# Altium schematic sheet Digital Isolation.SchDoc
size A4; SheetNumber: 5; SheetTotal: 7
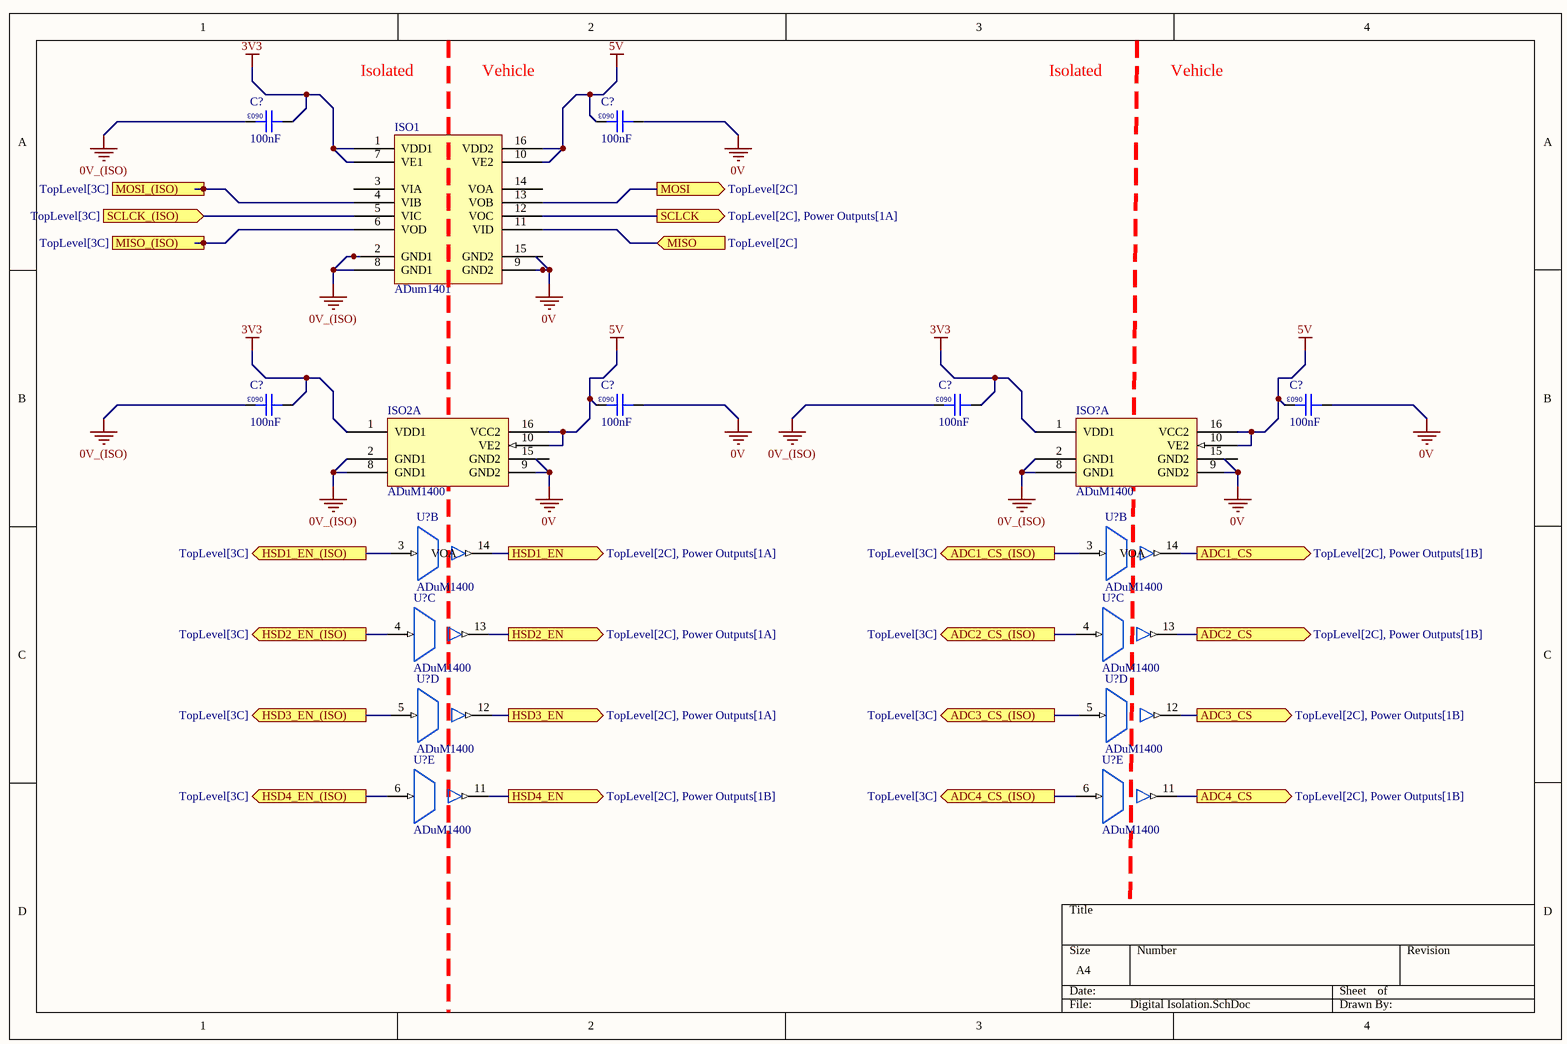
[diagram p0: Digital Isolation.SchDoc]

## Parts
(Parts that share a designator on the sheet are numbered #1, #2 ... from top to bottom, then left to right.)
C?#1  100nF  [0603]
C?#2  100nF  [0603]
C?#3  100nF  [0603]
C?#4  100nF  [0603]
C?#5  100nF  [0603]
C?#6  100nF  [0603]
ISO1  ADum1401  [AD 16-SOIC]
ISO2  ADuM1400  [AD 16-SOIC]  (part A of 5)
ISO?  ADuM1400  [AD 16-SOIC]  (part A of 5)
U?#1  ADuM1400  [AD 16-SOIC]  (part B of 5)
U?#2  ADuM1400  [AD 16-SOIC]  (part B of 5)
U?#3  ADuM1400  [AD 16-SOIC]  (part C of 5)
U?#4  ADuM1400  [AD 16-SOIC]  (part C of 5)
U?#5  ADuM1400  [AD 16-SOIC]  (part D of 5)
U?#6  ADuM1400  [AD 16-SOIC]  (part D of 5)
U?#7  ADuM1400  [AD 16-SOIC]  (part E of 5)
U?#8  ADuM1400  [AD 16-SOIC]  (part E of 5)

## Ports
ADC1_CS (out, see TopLevel[2C], Power Outputs[1B]), ADC1_CS_(ISO) (out, see TopLevel[3C]), ADC2_CS (out, see TopLevel[2C], Power Outputs[1B]), ADC2_CS_(ISO) (out, see TopLevel[3C]), ADC3_CS (out, see TopLevel[2C], Power Outputs[1B]), ADC3_CS_(ISO) (out, see TopLevel[3C]), ADC4_CS (out, see TopLevel[2C], Power Outputs[1B]), ADC4_CS_(ISO) (out, see TopLevel[3C]), HSD1_EN (out, see TopLevel[2C], Power Outputs[1A]), HSD1_EN_(ISO) (out, see TopLevel[3C]), HSD2_EN (out, see TopLevel[2C], Power Outputs[1A]), HSD2_EN_(ISO) (out, see TopLevel[3C]), HSD3_EN (out, see TopLevel[2C], Power Outputs[1A]), HSD3_EN_(ISO) (out, see TopLevel[3C]), HSD4_EN (out, see TopLevel[2C], Power Outputs[1B]), HSD4_EN_(ISO) (out, see TopLevel[3C]), MISO (in, see TopLevel[2C]), MISO_(ISO) (out, see TopLevel[3C]), MOSI (out, see TopLevel[2C]), MOSI_(ISO) (in, see TopLevel[3C]), SCLCK (out, see TopLevel[2C], Power Outputs[1A]), SCLCK_(ISO) (in, see TopLevel[3C])

## Nets
0V: C?#2.1 C?#4.1 C?#6.1 ISO1.9(GND2) ISO2.9(GND2) ISO?.9(GND2)
0V_(ISO): C?#1.2 C?#3.2 C?#5.2 ISO1.2(GND1) ISO1.8(GND1) ISO2.2(GND1) ISO2.8(GND1) ISO?.2(GND1) ISO?.8(GND1)
3V3: C?#1.1 C?#3.1 C?#5.1 ISO1.1(VDD1) ISO1.7(VE1) ISO2.1(VDD1) ISO?.1(VDD1)
5V: C?#2.2 C?#4.2 C?#6.2 ISO1.10(VE2) ISO1.16(VDD2) ISO2.10(VE2) ISO2.16(VCC2) ISO?.10(VE2) ISO?.16(VCC2)
ADC1_CS: U?#2.14(VOA) ; port ADC1_CS
ADC1_CS_(ISO): U?#2.3(VIA) ; port ADC1_CS_(ISO)
ADC2_CS: U?#4.13(VOB) ; port ADC2_CS
ADC2_CS_(ISO): U?#4.4(VIB) ; port ADC2_CS_(ISO)
ADC3_CS: U?#6.12(VOC) ; port ADC3_CS
ADC3_CS_(ISO): U?#6.5(VIC) ; port ADC3_CS_(ISO)
ADC4_CS: U?#8.11(VOD) ; port ADC4_CS
ADC4_CS_(ISO): U?#8.6(VID) ; port ADC4_CS_(ISO)
HSD1_EN: U?#1.14(VOA) ; port HSD1_EN
HSD1_EN_(ISO): U?#1.3(VIA) ; port HSD1_EN_(ISO)
HSD2_EN: U?#3.13(VOB) ; port HSD2_EN
HSD2_EN_(ISO): U?#3.4(VIB) ; port HSD2_EN_(ISO)
HSD3_EN: U?#5.12(VOC) ; port HSD3_EN
HSD3_EN_(ISO): U?#5.5(VIC) ; port HSD3_EN_(ISO)
HSD4_EN: U?#7.11(VOD) ; port HSD4_EN
HSD4_EN_(ISO): U?#7.6(VID) ; port HSD4_EN_(ISO)
MISO: ISO1.11(VID) ; port MISO
MISO_(ISO): ISO1.6(VOD) ; port MISO_(ISO)
MOSI: ISO1.13(VOB) ; port MOSI
MOSI_(ISO): ISO1.4(VIB) ; port MOSI_(ISO)
SCLCK: ISO1.12(VOC) ; port SCLCK
SCLCK_(ISO): ISO1.5(VIC) ; port SCLCK_(ISO)

Not connected (* = marked no-connect by the designer): ISO1 3(VIA) 14(VOA) 15(GND2); ISO2 15(GND2); ISO? 15(GND2)

## Notes on the sheet
- Isolated
- Vehicle
- (in symbol GCM188L81H104KA57D) 0603

## Library data of the parts
C?#1-C?#6 = GCM188L81H104KA57D: Manufacturer: muRata; Rated Voltage: 50V; Tolerance: ±10%; Material: MLCC; Temperature Rating: X8L; Part Number: GCM188L81H104KA57D; Value: 100nF; Digikey Part Number: 490-6049-1-ND
ISO1 = ADuM1401: General Purpose Digital Isolator 2500Vrms 4 Channel 1Mbps 25kV/µs CMTI 16-SOIC (0.295", 7.50mm Width); Manufacturer: Analog Devices; Complex IC: 0; Part Number: ADuM1401
ISO2 ISO? U?#1-U?#8 = ADuM1400: General Purpose Digital Isolator 2500Vrms 4 Channel 1Mbps 25kV/µs CMTI 16-SOIC (0.295", 7.50mm Width); Manufacturer: Analog Devices; Complex IC: 0; Part Number: ADuM1400; Digikey Part Number: ADUM1400WSRWZ-ND; Digikey Link: https://www.digikey.com/product-detail/en/analog-devices-inc/ADUM1400WSRWZ/ADUM1400WSRWZ-ND/1873713